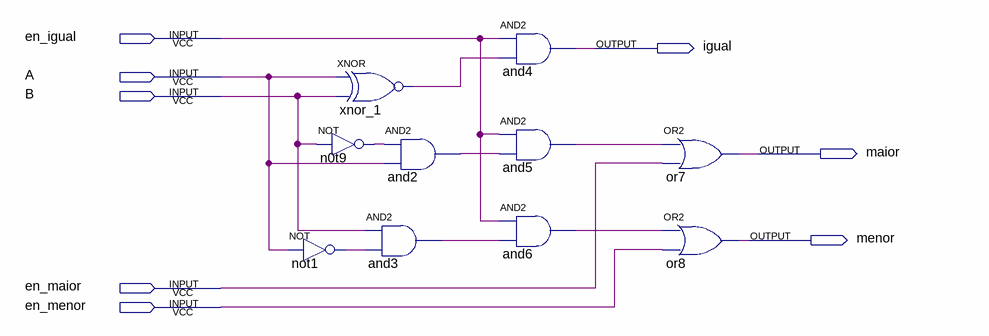
[diagram p0: schematic sheet]
// Quartus schematic comp_bit_cascata.bdf as structural Verilog: 10 symbols, 8 pins
module comp_bit_cascata (
  input  en_igual,
  input  A,
  input  B,
  input  en_maior,
  input  en_menor,
  output igual,
  output maior,
  output menor
);

  wire and2_out, and3_out, and5_out, and6_out, n0t9_out, not1_out, xnor_1_out;

  xnor xnor_1 (xnor_1_out, A, B);
  not n0t9 (n0t9_out, B);
  not not1 (not1_out, A);
  and and2 (and2_out, n0t9_out, A);
  and and3 (and3_out, B, not1_out);
  and and4 (igual, en_igual, xnor_1_out);
  and and5 (and5_out, en_igual, and2_out);
  and and6 (and6_out, en_igual, and3_out);
  or or7 (maior, and5_out, en_maior);
  or or8 (menor, and6_out, en_menor);
endmodule
